# Altium schematic sheet 温度与电流采集.SchDoc
size A4
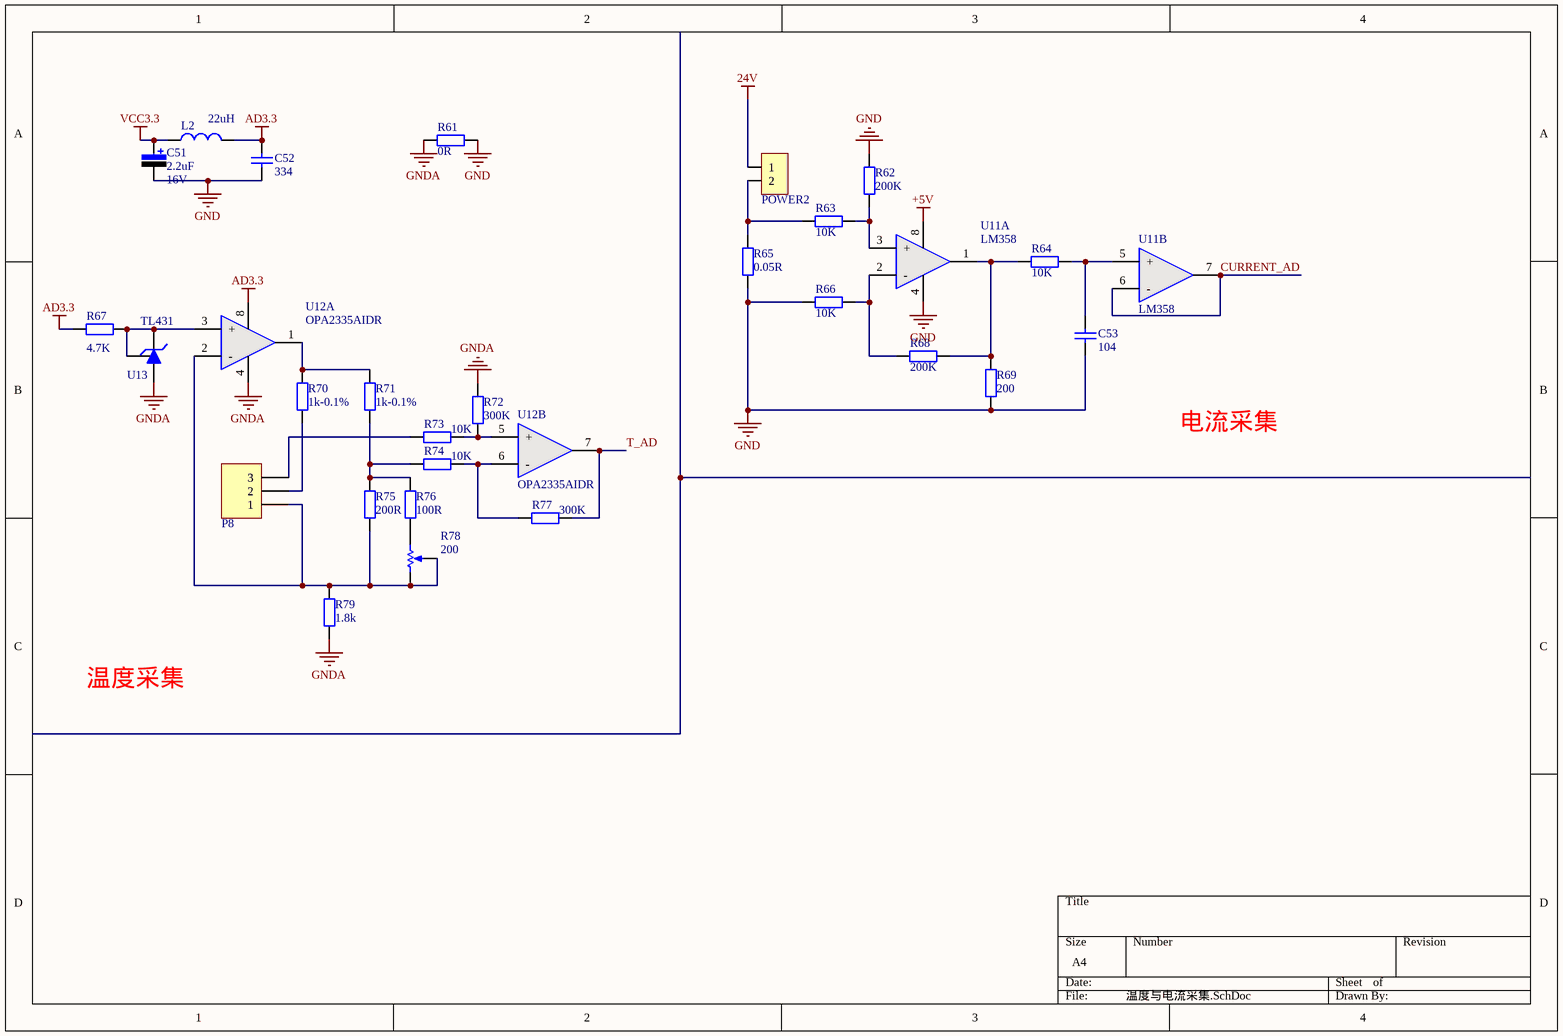
[diagram p0: 温度与电流采集.SchDoc]

## Parts
C51  value 2.2uF  Vol: 16V  [CAP-3216]  (hidden comment: Cap Pol)
C52  value 334  [C-RAD-0603]  (hidden comment: Cap)
C53  value 104  [C-RAD-0603]  (hidden comment: Cap)
L2  value 22uH  [0805-1]  (hidden comment: Inductor)
P8  Header 3  [XH2.54*3卧贴]  (value not drawn)
POWER2  CNT5.08MM*2 WAN  [CNT5.08*2WAN]  (value not drawn)
R61  value 0R  [0603-1]  (hidden comment: Res1)
R62  value 200K  [0603-1]  (hidden comment: Res1)
R63  value 10K  [0603-1]  (hidden comment: Res1)
R64  value 10K  [0603-1]  (hidden comment: Res1)
R65  value 0.05R  [1*8*50mR]  (hidden comment: Res1)
R66  value 10K  [0603-1]  (hidden comment: Res1)
R67  value 4.7K  [0603-1]  (hidden comment: Res1)
R68  value 200K  [0603-1]  (hidden comment: Res1)
R69  value 200  [0603-1]  (hidden comment: Res1)
R70  value 1k-0.1%  [0603-1]  (hidden comment: Res1)
R71  value 1k-0.1%  [0603-1]  (hidden comment: Res1)
R72  value 300K  [0603-1]  (hidden comment: Res1)
R73  value 10K  [0603-1]  (hidden comment: Res1)
R74  value 10K  [0603-1]  (hidden comment: Res1)
R75  value 200R  [0603-1]  (hidden comment: Res1)
R76  value 100R  [0603-1]  (hidden comment: Res1)
R77  value 300K  [0603-1]  (hidden comment: Res1)
R78  value 200  [VR-3266W]  (hidden comment: RPot)
R79  value 1.8k  [0603-1]  (hidden comment: Res1)
U11  LM358  [NSO8_N]  (parts A,B of 2)
U12  OPA2335AIDR  [NSO8_N]  (parts A,B of 2)
U13  TL431  [SOT23]

## Nets
24V: POWER2.1
+5V: U11.8(V+)
AD3.3: C52.1 L2.2 R67.1 U12.8(V+)
GND: C51.2 C52.2 C53.1 R61.1 R62.2 R65.1 R66.1 R69.1 U11.4(V-)
GNDA: R61.2 R72.2 R79.1 U12.4(V-) U13.3
VCC3.3: C51.1 L2.1
CURRENT_AD: U11.6(-) U11.7(OUT2)
T_AD: R77.2 U12.7(OUT2)
NetC53_2: C53.2 R64.1 U11.5(+)
NetP8_1: P8.1 R75.1 R78.1(TOP) R78.2(TAP) R79.2 U12.2(-)
NetP8_2: P8.2 R70.1
NetP8_3: P8.3 R73.1
NetPOWER2_2: POWER2.2 R63.1 R65.2
NetR62_1: R62.1 R63.2 U11.3(+)
NetR64_2: R64.2 R68.1 R69.2 U11.1(OUT1)
NetR66_2: R66.2 R68.2 U11.2(-)
NetR67_2: R67.2 U12.3(+) U13.1 U13.2
NetR70_2: R70.2 R71.2 U12.1(OUT1)
NetR71_1: R71.1 R74.1 R75.2 R76.2
NetR72_1: R72.1 R73.2 U12.5(+)
NetR74_2: R74.2 R77.1 U12.6(-)
NetR76_1: R76.1 R78.3(BOT)

## Notes on the sheet
- 电流采集
- 温度采集

## Library data of the parts
C51 = Cap Pol: 极性电解电容; Published: 8-Jun-2000; LatestRevisionDate: 17-Jul-2002; LatestRevisionNote: Re-released for DXP Platform.; PackageReference: RB7.6-15; Publisher: Altium Limited
C52 C53 = Cap: 无极性电容; Published: 8-Jun-2000; LatestRevisionDate: 17-Jul-2002; LatestRevisionNote: Re-released for DXP Platform.; PackageReference: RAD-0.3; Publisher: Altium Limited
L2 = Inductor: 电感; Code_IEC: 1005; Published: 8-Jun-2000; LatestRevisionDate: 17-Jul-2002; LatestRevisionNote: Re-released for DXP Platform.; PackageReference: 0402-A; Publisher: Altium Limited; Code_JEITA: 0402
P8 = Header 3: 接插件; LatestRevisionDate: 17-Jul-2002; LatestRevisionNote: Re-released for DXP Platform.; Publisher: Altium Limited
R61-R77 R79 = Res1: 贴片电阻; Published: 8-Jun-2000; LatestRevisionDate: 17-Jul-2002; LatestRevisionNote: Re-released for DXP Platform.; PackageReference: AXIAL-0.4; Publisher: Altium Limited
R78 = RPot: 精密可调电阻; Sim Note: Enter the Resistance value and the set point into parameter fields.; Set Position: 0.5; Published: 8-Jun-2000; LatestRevisionDate: 17-Jul-2002; LatestRevisionNote: Re-released for DXP Platform.; PackageReference: VR5; Publisher: Altium Limited
U11 = LM358: 双运放
U12 = AD8667: 双运放